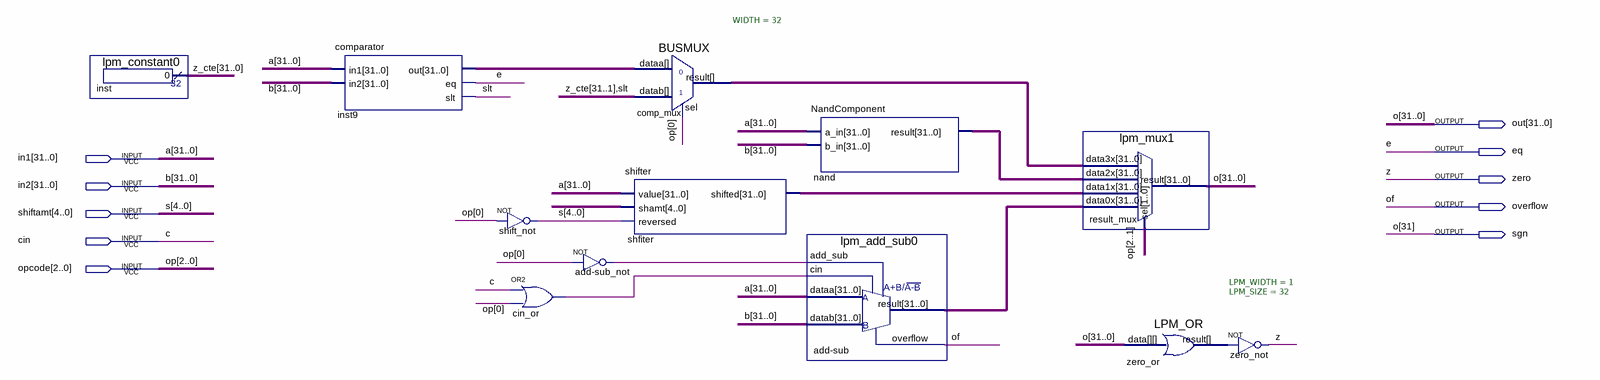
[diagram p0: schematic sheet]
// Quartus schematic alu.bdf as structural Verilog: 12 symbols, 10 pins
module alu (
  input  [31:0] in1,
  input  [31:0] in2,
  input  [4:0] shiftamt,
  input  cin,
  input  [2:0] opcode,
  output [31:0] out,
  output eq,
  output zero,
  output overflow,
  output sgn
);

  wire add_sub_not_out, cin_or_out, shift_not_out, slt, zero_or_result;
  wire [31:0] add_sub_result, comp_mux_result, inst9_out, nand_result, shfiter_shifted, z_cte;

  lpm_constant0 inst (.result(z_cte));
  comparator inst9 (.in1(in1), .in2(in2), .out(inst9_out), .eq(eq), .slt(slt));
  not shift_not (shift_not_out, opcode[0]);
  or cin_or (cin_or_out, cin, opcode[0]);
  not \add-sub_not  (add_sub_not_out, opcode[0]);
  BUSMUX #(.WIDTH(32)) comp_mux (
    .datab({z_cte[31:1], slt}), .sel(opcode[0]), .dataa(inst9_out), .result(comp_mux_result));
  shifter shfiter (.value(in1), .shamt(shiftamt), .reversed(shift_not_out), .shifted(shfiter_shifted));
  NandComponent \nand  (.a_in(in1), .b_in(in2), .result(nand_result));
  lpm_add_sub0 \add-sub  (
    .cin(cin_or_out), .add_sub(add_sub_not_out), .dataa(in1), .datab(in2), .result(add_sub_result),
    .overflow(overflow));
  lpm_mux1 result_mux (
    .data3x(comp_mux_result), .data2x(nand_result), .data1x(shfiter_shifted), .data0x(add_sub_result),
    .sel(opcode[2:1]), .result(out));
  LPM_OR #(.LPM_WIDTH(1), .LPM_SIZE(32)) zero_or (.data(out), .result(zero_or_result));
  not zero_not (zero, zero_or_result);

  assign sgn = out[31];

  // Other names for the same wires on the sheet: a[31:0] = in1; b[31:0] = in2; c = cin; e = eq; o[31:0] = out;
  //   of = overflow; op[2:0] = opcode; s[4:0] = shiftamt; z = zero
endmodule
